# EAGLE design MD (EAGLE 9.6.2)

## Sheet 1 of 2
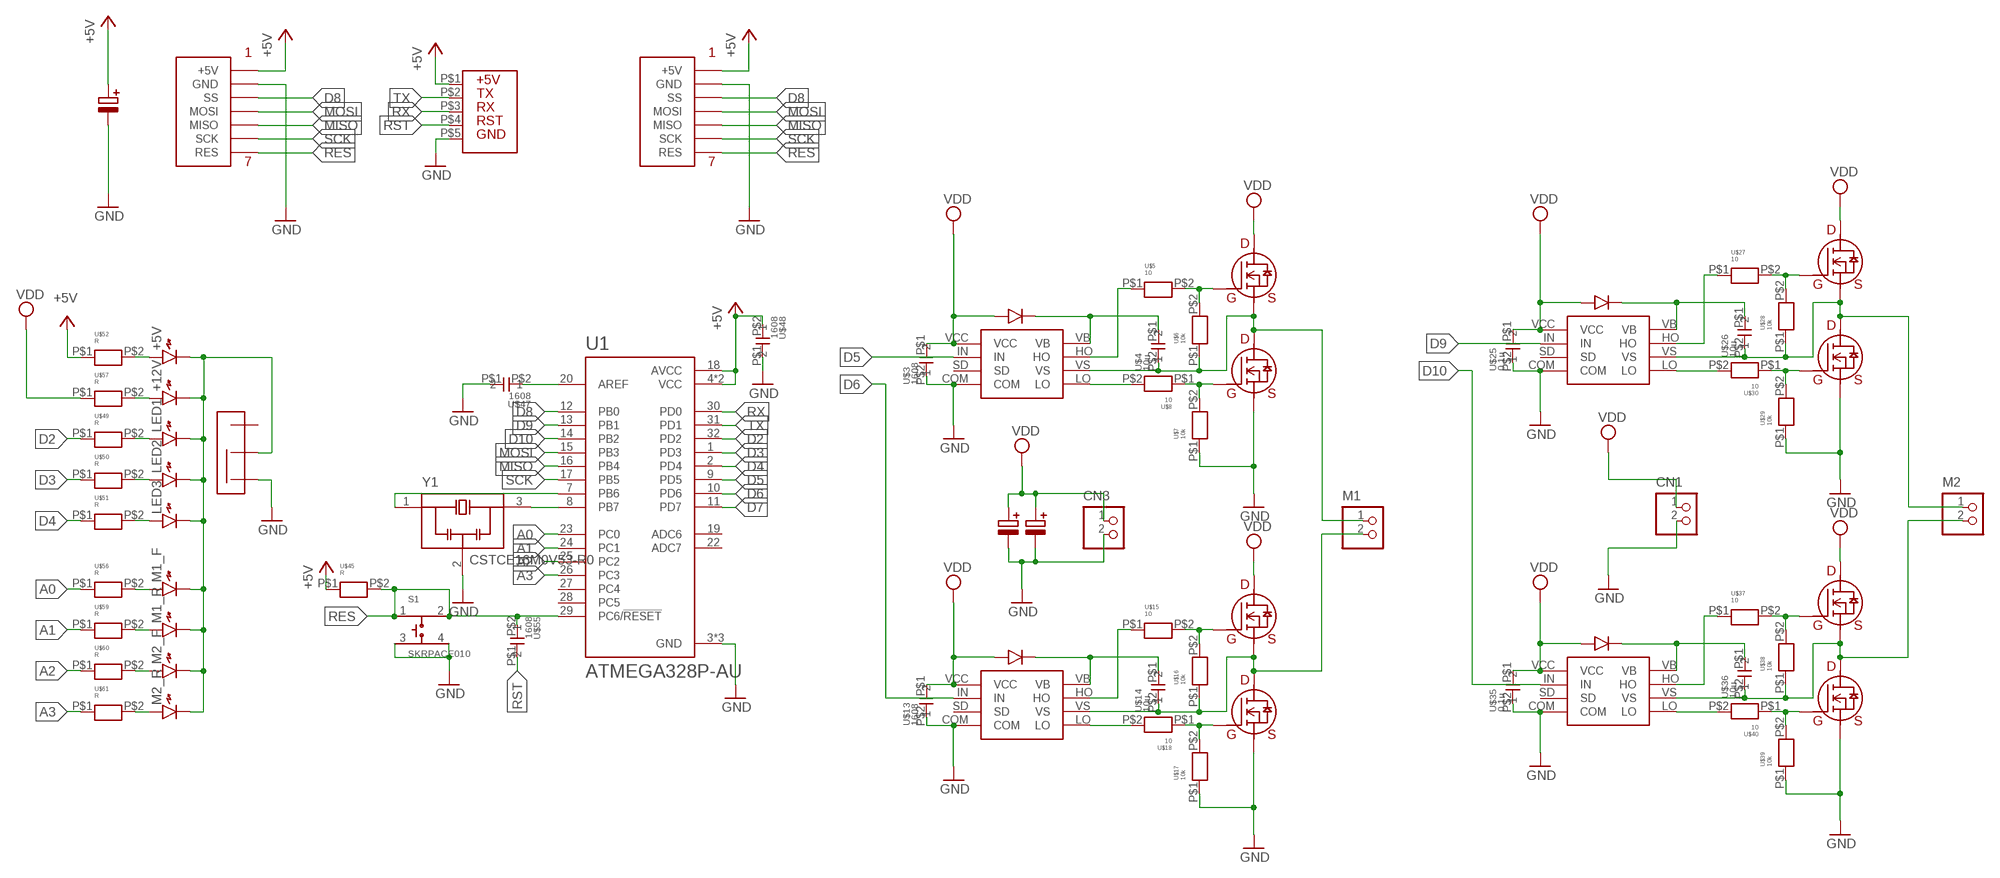
[diagram p0: schematic, sheet 1]

### Parts
+5V  LED1608  [LED1608]
+12V  LED1608  [LED1608]
CN1  B2B-XH-A  [B2B-XH-A]
CN3  B2B-XH-A  [B2B-XH-A]
LED1  LED1608  [LED1608]
LED2  LED1608  [LED1608]
LED3  LED1608  [LED1608]
M1  S2B-XH-A  [S2B-XH-A]
M1_F  LED1608  [LED1608]
M1_R  LED1608  [LED1608]
M2  S2B-XH-A  [S2B-XH-A]
M2_F  LED1608  [LED1608]
M2_R  LED1608  [LED1608]
S1  SKRPACE010  [SW_SKRPACE010]
U1  ATMEGA328P-AU  [QFP80P900X900X120-32N]
U$1  IR2302  [IR2302]
U$2  1N4148  [1N4148]
U$3  1608  [CON]
U$4  10u  1608  [CON]
U$5  10  R  [1608]
U$6  10k  R  [1608]
U$7  10k  R  [1608]
U$8  10  R  [1608]
U$9  TK8S06K3L  [TK8S06K3L]
U$10  TK8S06K3L  [TK8S06K3L]
U$11  IR2302  [IR2302]
U$12  1N4148  [1N4148]
U$13  1608  [CON]
U$14  10u  1608  [CON]
U$15  10  R  [1608]
U$16  10k  R  [1608]
U$17  10k  R  [1608]
U$18  10  R  [1608]
U$19  TK8S06K3L  [TK8S06K3L]
U$20  TK8S06K3L  [TK8S06K3L]
U$21  25V100  [25V100]
U$22  25V100  [25V100]
U$23  IR2302  [IR2302]
U$24  1N4148  [1N4148]
U$25  0.1u  1608  [CON]
U$26  10u  1608  [CON]
U$27  10  R  [1608]
U$28  10k  R  [1608]
U$29  10k  R  [1608]
U$30  10  R  [1608]
U$31  TK8S06K3L  [TK8S06K3L]
U$32  TK8S06K3L  [TK8S06K3L]
U$33  IR2302  [IR2302]
U$34  1N4148  [1N4148]
U$35  0.1u  1608  [CON]
U$36  10u  1608  [CON]
U$37  10  R  [1608]
U$38  10k  R  [1608]
U$39  10k  R  [1608]
U$40  10  R  [1608]
U$41  TK8S06K3L  [TK8S06K3L]
U$42  TK8S06K3L  [TK8S06K3L]
U$45  R  [1608]
U$46  SPI  [SPI]
U$47  1608  [CON]
U$48  1608  [CON]
U$49  R  [1608]
U$50  R  [1608]
U$51  R  [1608]
U$52  R  [1608]
U$53  SSW  [SSW]
U$54  SI  [SI]
U$55  1608  [CON]
U$56  R  [1608]
U$57  R  [1608]
U$58  25V100  [25V100]
U$59  R  [1608]
U$60  R  [1608]
U$61  R  [1608]
U$62  SPI  [SPI]
Y1  CSTCE16M0V53-R0  [OSC_CSTCE16M0V53-R0]

### Nets
+5V: U1.4(VCC) U1.6(VCC) U1.18(AVCC) U$45.P$1 U$46.P$1(+5V) U$48.P$2 U$52.P$1 U$54.P$1 U$58.P$1 U$62.P$1(+5V)
A0: U1.23(PC0) U$56.P$1
A1: U1.24(PC1) U$59.P$1
A2: U1.25(PC2) U$60.P$1
A3: U1.26(PC3) U$61.P$1
D2: U1.32(PD2) U$49.P$1
D3: U1.1(PD3) U$50.P$1
D4: U1.2(PD4) U$51.P$1
D5: U1.9(PD5) U$1.IN
D6: U1.10(PD6) U$11.IN
D7: U1.11(PD7)
D8: U1.12(PB0) U$46.P$3(SS) U$62.P$3(SS)
D9: U1.13(PB1) U$23.IN
D10: U1.14(PB2) U$33.IN
GND: CN1.2 CN3.2 S1.3 S1.4 U1.3(GND) U1.5(GND) U1.21(GND) U$1.COM U$3.P$2 U$7.P$1 U$10.S U$11.COM U$13.P$2 U$17.P$1 U$20.S U$21.P$2 U$22.P$2 U$23.COM U$25.P$2 U$29.P$1 U$32.S U$33.COM U$35.P$2 U$39.P$1 U$42.S U$46.P$2(GND) U$47.P$1 U$48.P$1 U$53.P$1 U$54.P$5 U$58.P$2 U$62.P$2(GND) Y1.2(GND)
MISO: U1.16(PB4) U$46.P$5(MISO) U$62.P$5(MISO)
MOSI: U1.15(PB3) U$46.P$4(MOSI) U$62.P$4(MOSI)
N$1: U$23.VB U$24.P$2 U$26.P$1
N$2: M2.1 U$23.VS U$26.P$2 U$28.P$1 U$31.S U$32.D
N$3: U$1.VB U$2.P$2 U$4.P$1
N$4: M1.1 U$1.VS U$4.P$2 U$6.P$1 U$9.S U$10.D
N$5: LED1.A U$49.P$2
N$6: U$5.P$2 U$6.P$2 U$9.G
N$7: U$1.HO U$5.P$1
N$8: U$1.LO U$8.P$2
N$9: U$7.P$2 U$8.P$1 U$10.G
N$10: U$27.P$2 U$28.P$2 U$31.G
N$11: U$23.HO U$27.P$1
N$12: U$11.VB U$12.P$2 U$14.P$1
N$13: M1.2 U$11.VS U$14.P$2 U$16.P$1 U$19.S U$20.D
N$14: U$15.P$2 U$16.P$2 U$19.G
N$15: U$11.HO U$15.P$1
N$16: U$11.LO U$18.P$2
N$17: U$17.P$2 U$18.P$1 U$20.G
N$18: LED2.A U$50.P$2
N$19: U$23.LO U$30.P$2
N$20: U$29.P$2 U$30.P$1 U$32.G
N$21: LED3.A U$51.P$2
N$22: U$33.VB U$34.P$2 U$36.P$1
N$23: M2.2 U$33.VS U$36.P$2 U$38.P$1 U$41.S U$42.D
N$24: U$37.P$2 U$38.P$2 U$41.G
N$25: U$33.HO U$37.P$1
N$26: U$33.LO U$40.P$2
N$27: U$39.P$2 U$40.P$1 U$42.G
N$28: +5V.A U$52.P$2
N$29: +5V.K +12V.K LED1.K LED2.K LED3.K M1_F.K M1_R.K M2_F.K M2_R.K U$53.P$3
N$30: +12V.A U$57.P$2
N$33: M1_R.A U$59.P$2
N$34: M1_F.A U$56.P$2
N$37: M2_R.A U$61.P$2
N$38: M2_F.A U$60.P$2
N$39: U1.8(PB7) Y1.3(OUT)
N$40: U1.7(PB6) Y1.1(IN)
N$47: U1.20(AREF) U$47.P$2
RES: S1.1 S1.2 U1.29(PC6/!RESET) U$45.P$2 U$46.P$7(RES) U$55.P$2 U$62.P$7(RES)
RST: U$54.P$4 U$55.P$1
RX: U1.30(PD0) U$54.P$3
SCK: U1.17(PB5) U$46.P$6(SCK) U$62.P$6(SCK)
TX: U1.31(PD1) U$54.P$2
VDD: CN1.1 CN3.1 U$1.VCC U$2.P$1 U$3.P$1 U$9.D U$11.VCC U$12.P$1 U$13.P$1 U$19.D U$21.P$1 U$22.P$1 U$23.VCC U$24.P$1 U$25.P$1 U$31.D U$33.VCC U$34.P$1 U$35.P$1 U$41.D U$57.P$1
Unconnected: U1.19(ADC6) U1.22(ADC7) U1.27(PC4) U1.28(PC5) U$1.SD U$11.SD U$23.SD U$33.SD U$53.P$2

## Sheet 2 of 2

## Library data of the parts
+5V +12V LED1-LED3 M1_F M1_R M2_F M2_R = generic:LED: Generic LEDs
CN1 CN3 = jst-xh:B2B-XH-A: Wire-to-Board 2.5mm pitch top mount connector Source: http://www.jst-mfg.com/product/pdf/jpn/XH.pdf http://www.jst-mfg.com/product/detail.php?series=277
M1 M2 = jst-xh:S2B-XH-A: Wire-to-Board 2.5mm pitch side mount connector Source: http://www.jst-mfg.com/product/pdf/jpn/XH.pdf http://www.jst-mfg.com/product/detail.php?series=277
S1 = SKRPACE010:SKRPACE010: Switch Tactile N.O. SPST Button J-Bend 0.05A 16VDC 2.55N SMD Automotive T/R Check prices <https://pricing.snapeda.com/parts/SKRPACE010/ALPS/view-part?ref=eda>; AVAILABILITY: In Stock; DESCRIPTION: Switch Tactile N.O. SPST Button J-Bend 0.05A 16VDC 2.55N SMD Automotive T/R; MF: ALPS; MP: SKRPACE010; PACKAGE: None; PRICE: None
U1 = ATMEGA328P-AU:ATMEGA328P-AU: ATmega Series 20 MHz 32 KB Flash 2 KB SRAM 8-Bit Microcontroller - TQFP-32 Check prices <https://pricing.snapeda.com/parts/ATMEGA328P-AU/Microchip%20Technology/view-part?ref=eda>; AVAILABILITY: In Stock; DESCRIPTION: AVR AVR® ATmega Microcontroller IC 8-Bit 20MHz 32KB (16K x 16) FLASH 32-TQFP (7x7); MF: Microchip Technology; MP: ATMEGA328P-AU; PACKAGE: TQFP-32 Microchip; PRICE: None
U$1 U$11 U$23 U$33 = IR2302:IR2302
U$2 U$12 U$24 U$34 = 1N4148:1N4148
U$3 U$4 U$13 U$14 U$25 U$26 U$35 U$36 U$47 U$48 U$55 = con1608:1608
U$5-U$8 U$15-U$18 U$27-U$30 U$37-U$40 U$45 U$49-U$52 U$56 U$57 U$59-U$61 = R 1608:R
U$9 U$10 U$19 U$20 U$31 U$32 U$41 U$42 = TK8S06K3L:TK8S06K3L
U$21 U$22 U$58 = 100uF25V 電解:25V100
U$46 U$62 = SPI用PH7ピン:SPI
U$53 = SSW:SSW
U$54 = プログラム入力:SI
Y1 = CSTCE16M0V53-R0:CSTCE16M0V53-R0: 20MHz Ceramic Resonator Built in Capacitor 15pF +/- 0.2% -40C - 125C Surface Mount; MANUFACTURER: Murata; MAXIMUM_PACKAGE_HEIGHT: 1.00mm; PARTREV: May 7, 2019; STANDARD: Manufacturer Recommendations

## Board
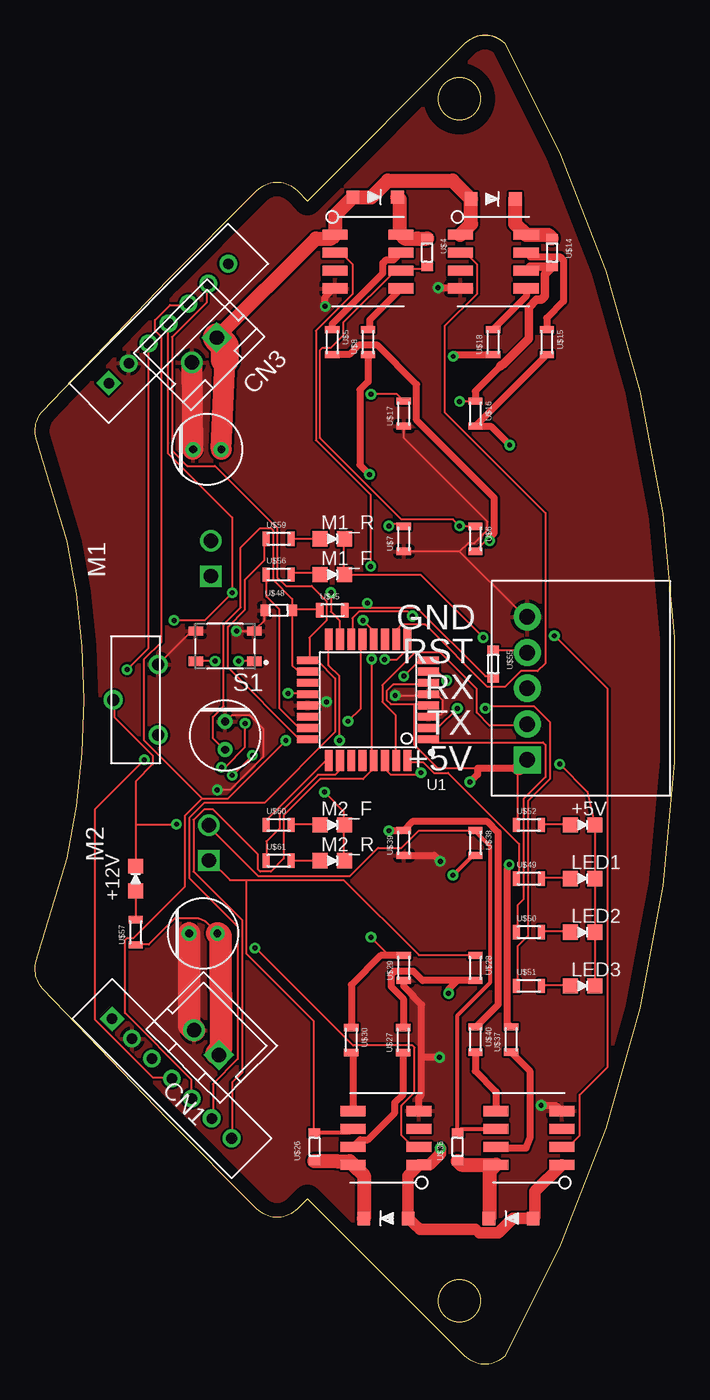
[diagram p1: board, top side]
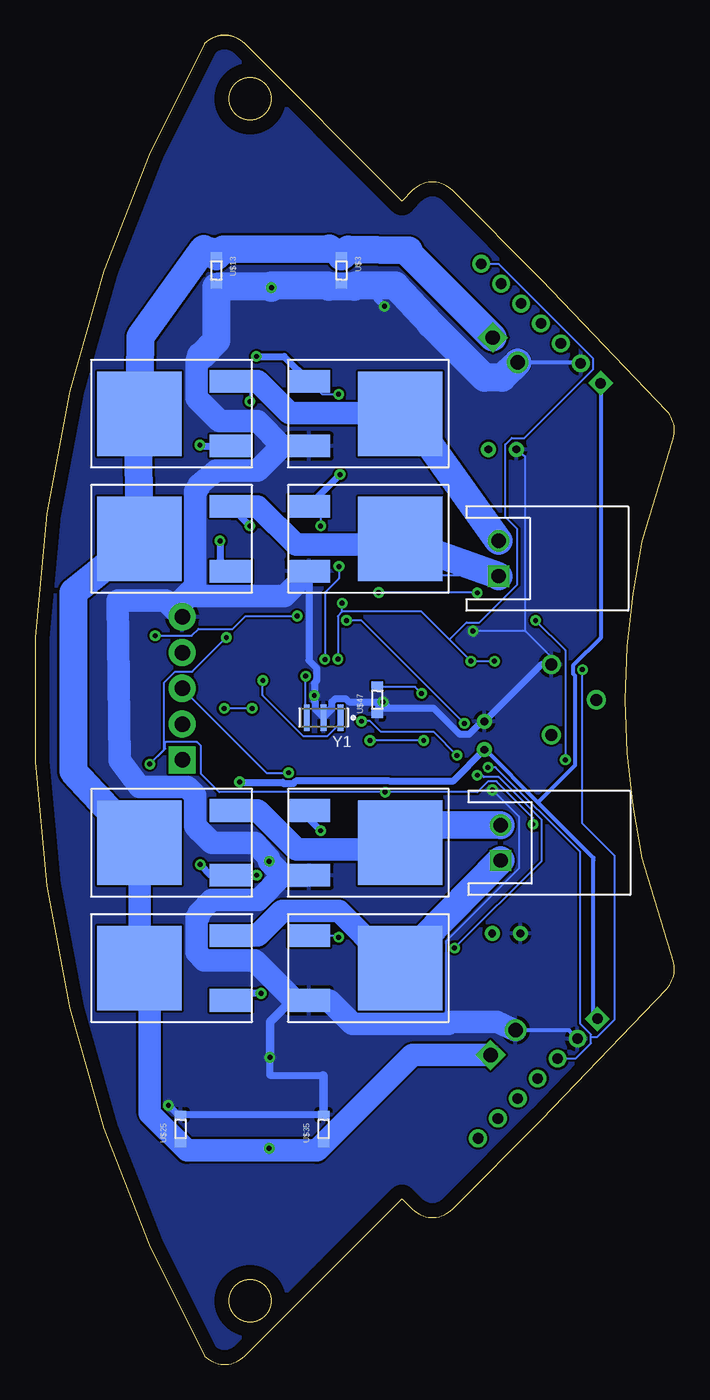
[diagram p2: board, bottom side, seen from below]

Size 45.4 x 94.38 mm. Coordinates in mm from the lower left corner, seen from the top.
Outline: 33.36,93.8 arc90 30.54,93.8
Outline: 30.54,93.8 19.35,82.61 18.6,83.37 arc90 15.77,83.37 9.41,77 0.55,67.71 arc60 0.08,65.75 2.27,58.46 arc-24 2.27,35.92 0.08,28.63 arc60 0.55,26.68 9.41,17.38 15.77,11.02 arc90 18.6,11.02 19.35,11.77 30.54,0.58 arc90 33.36,0.58 arc58 33.36,93.8
Outline: 30.54,93.8 arc-90 33.36,93.8
Outline: circle at 30.14,89.87 radius 1.5
Outline: circle at 30.14,89.87 radius 1.5
Outline: circle at 30.14,4.52 radius 1.5
Copper layers (1*16): Top 0.035mm / dielectric 1.5mm / Bottom 0.035mm
Design rules "default": minimum track width 6mil, minimum drill 0.35mm, track to track 6mil, track to pad 6mil, pad to pad 6mil, via to via 6mil, smd to smd 6mil, copper to edge 40mil, drill to drill 6mil, minimum pad ring 10mil, minimum via ring 8mil, stop-mask expansion 4mil, vias tented up to drill 0mil, thermal gap 10mil

### Footprints (pad centres in the part's own frame; a part is rotated, then mirrored left to right if it is on the bottom)
LED1608 = smd 1.05 x 1.08: A -0.875,0; K 0.875,0
B2B-XH-A = drill 1.016 square: 1 -1.25,0 | drill 1.016: 2 1.25,0
S2B-XH-A = drill 1.016 square: 1 1.25,0 | drill 1.016: 2 -1.25,0
SW_SKRPACE010 = smd 1.05 x 0.65: 1 -2.075,1.075; 2 2.075,1.075; 3 -2.075,-1.075; 4 2.075,-1.075
QFP80P900X900X120-32N = smd 1.5 x 0.55: 1 -4.3,2.8; 2 -4.3,2; 3 -4.3,1.2; 4 -4.3,0.4; 5 -4.3,-0.4; 6 -4.3,-1.2; 7 -4.3,-2; 8 -4.3,-2.8; 17 4.3,-2.8; 18 4.3,-2; 19 4.3,-1.2; 20 4.3,-0.4; 21 4.3,0.4; 22 4.3,1.2; 23 4.3,2; 24 4.3,2.8 | smd 0.55 x 1.5: 9 -2.8,-4.3; 10 -2,-4.3; 11 -1.2,-4.3; 12 -0.4,-4.3; 13 0.4,-4.3; 14 1.2,-4.3; 15 2,-4.3; 16 2.8,-4.3; 25 2.8,4.3; 26 2,4.3; 27 1.2,4.3; 28 0.4,4.3; 29 -0.4,4.3; 30 -1.2,4.3; 31 -2,4.3; 32 -2.8,4.3
IR2302 = smd 1.78 x 0.72: COM -2.34,0; HO 2.34,2.54; IN -2.34,2.54; LO 2.34,0; SD -2.34,1.27; VB 2.34,3.81; VCC -2.34,3.81; VS 2.34,1.27
1N4148 = smd 0.9 x 0.95: P$1 -1.575,0; P$2 1.575,0
CON = smd 0.6 x 0.813: P$1 -1,0; P$2 1,0
1608 = smd 0.508 x 1.016: P$1 -0.889,0; P$2 0.889,0
TK8S06K3L = smd 6 x 6: D 0,8 | smd 1.6 x 3: G -2.3,1.5; S 2.3,1.5
25V100 = drill 0.55: P$1 -1,0; P$2 1,0
SPI = drill 0.75 square: P$1 0,0 | drill 0.75: P$2 2,0; P$3 4,0; P$4 6,0; P$5 8,0; P$6 10,0; P$7 12,0
SSW = drill 0.85: P$1 -2.5,1.6; P$2 2.5,1.6; P$3 0,-1.6
SI = drill 1.1 pad 1.93 square: P$1 -7.62,0 | drill 1.1 pad 1.93: P$2 -5.08,0; P$3 -2.54,0; P$4 0,0; P$5 2.54,0
OSC_CSTCE16M0V53-R0 = smd 0.4 x 1.9: 1 -1.2,0; 2 0,0; 3 1.2,0

### Placement (x,y rotation side)
+5V  38.89,38.3 0 top
+12V  7.14,34.49 90 top
CN1  12.17,22.84 135 top
CN3  12.02,72.03 225 top
LED1  38.89,34.49 0 top
LED2  38.89,30.68 0 top
LED3  38.89,26.87 0 top
M1  12.47,57.22 270 bottom
M1_F  21.11,56.08 0 top
M1_R  21.11,58.62 0 top
M2  12.34,37.03 270 bottom
M2_F  21.11,38.3 0 top
M2_R  21.11,35.76 0 top
S1  13.49,51 180 top
U1  23.65,47.19 180 top
U$1  23.65,76.4 0 top
U$2  24.15,82.88 0 top
U$3  23.65,77.67 270 bottom
U$4  27.84,78.94 270 top
U$5  21.11,72.59 270 top
U$6  31.27,58.62 270 top
U$7  26.19,58.62 90 top
U$8  23.65,72.59 90 top
U$9  30,58.62 90 bottom
U$10  27.46,58.62 270 bottom
U$11  32.54,76.4 0 top
U$12  32.54,82.75 0 top
U$13  32.54,77.67 270 bottom
U$14  36.73,78.94 270 top
U$15  36.35,72.59 270 top
U$16  31.27,67.51 270 top
U$17  26.19,67.51 90 top
U$18  32.54,72.59 90 top
U$19  30,67.51 90 bottom
U$20  27.46,67.51 270 bottom
U$21  11.94,30.6 180 top
U$22  12.22,64.97 180 top
U$23  24.92,17.98 180 top
U$24  24.92,10.36 180 top
U$25  35.08,16.71 90 bottom
U$26  19.84,15.44 90 top
U$27  26.15,23.02 90 top
U$28  31.27,28.14 270 top
U$29  26.19,28.14 90 top
U$30  22.45,23.02 270 top
U$31  30,28.14 90 bottom
U$32  27.46,28.14 270 bottom
U$33  35.08,17.98 180 top
U$34  33.81,10.36 180 top
U$35  24.92,16.71 90 bottom
U$36  30,15.44 90 top
U$37  33.81,23.06 90 top
U$38  31.27,37.03 270 top
U$39  26.19,37.03 90 top
U$40  31.27,23.06 270 top
U$41  30,37.03 90 bottom
U$42  27.46,37.03 270 bottom
U$45  21.11,53.54 0 top
U$46  5.46,24.53 315 top
U$47  21.11,47.19 90 bottom
U$48  17.3,53.54 0 top
U$49  35.08,34.49 0 top
U$50  35.08,30.68 0 top
U$51  35.08,26.87 0 top
U$52  35.08,38.3 0 top
U$53  7.14,47.19 270 top
U$54  34.96,50.54 90 top
U$55  32.54,49.73 270 top
U$56  17.3,56.08 0 top
U$57  7.14,30.68 90 top
U$58  13.49,44.65 90 top
U$59  17.3,58.62 0 top
U$60  17.3,38.3 0 top
U$61  17.3,35.76 0 top
U$62  5.23,69.67 45 top
Y1  24.92,45.92 180 bottom

### Tracks (layer width: path | path; a pad name or v marks a point on that pad's centre or on a via)
+5V  (via drill 0.35)
  Top 0.152: 26.95,46.89 25.27,46.89 24.97,47.19 24.97,47.8 25.42,48.26 27.86,48.26 U1.6 | 26.95,46.89 27.86,46.89 U1.4 | U$52.P$1 34.26,38.35 34.26,42.01 33.96,42.31 31.42,42.31 28.62,42.31 26.95,43.99 26.95,46.89 | U$48.P$2 18.41,53.59 20.09,53.59 U$45.P$1 | U1.18 19.33,49.33 18.57,49.33 18.26,49.63 18.26,53.44 U$48.P$2 | U$48.P$2 18.26,53.59 18.26,54.35 16.89,55.73 16.89,59.23 16.74,59.38 15.98,59.38 14.6,58.01 14.6,53.74 13.38,52.53 13.38,46.73 12.62,45.97 12.62,44.45 13.38,43.69 U$58.P$1
  Top 0.5: v30.89,41.35 31.42,41.88 31.42,42.31 34.35,42.31
  Top 1: U$54.P$1 34.35,42.31
  Bottom 0.152: 13.38,43.53 U$58.P$1 | 16.03,41.4 30.89,41.4 v30.89,41.35
  Bottom 0.3: 9.69,39.92 7.07,42.54 7.07,48.9 7.21,49.04 7.21,49.61 5.23,51.58 U$62.P$1 | U$46.P$1 5.74,24.81 5.74,35.81 | 5.78,35.85 5.74,35.81 | 5.74,35.81 5.74,35.97 9.69,39.92 | U$58.P$1 13.42,43.65 9.69,39.92
  Bottom 0.5: U$58.P$1 15.74,41.4 16.03,41.4 20.21,41.4 20.22,41.42 26.89,41.42 27.08,41.23 27.73,41.23 27.82,41.32 30.86,41.32 v30.89,41.35
A0
  Top 0.152: U$56.P$1 16.43,56.03 16.43,54.51 17.35,53.59 17.35,46.58 18.72,45.21 19.33,45.21 U1.23
A1
  Top 0.152: U$59.P$1 16.28,58.62 16.28,57.1 14.91,55.73 14.91,53.59 13.69,52.37 13.69,49.48 18.72,44.45 19.33,44.45 U1.24
A2
  Top 0.152: U$60.P$1 16.43,38.35 16.43,38.66 20.7,42.92 U1.25
A3
  Top 0.152: U$61.P$1 16.43,35.76 16.43,37.13 17.35,38.05 17.35,39.11 20.09,41.86 21.31,41.86 21.61,42.16 21.61,42.77 U1.26
D2
  Top 0.152: U$49.P$1 34.37,34.67 34.37,36.97 29.32,42.01 28.32,42.01 27.56,42.77 26.49,42.77 U1.32
D3
  Top 0.152: U$50.P$1 34.26,30.73 34.26,32.59 34.7,33.02 34.7,40.16 36.24,41.71 36.24,43.99 36.07,44.17 28.14,44.17 28.02,44.3 U1.1
D4  (via drill 0.35)
  Top 0.152: v31.98,46.58 32.09,46.7 35.47,46.7 36.55,45.62 36.55,41.55 35.01,40.02 35.01,30.41 34.26,29.67 34.26,26.92 U$51.P$1 | v30,46.58 28.62,45.21 28.02,45.21 U1.2
  Bottom 0.152: v30,46.58 v31.98,46.58
D5  (via drill 0.35)
  Top 0.152: v24.83,50.06 25.7,50.06 26.34,50.7 26.34,51.46 U1.9 | v23.82,56.67 23.82,61.75 19.94,65.63 19.94,73.4 22.53,76 22.53,78.13 21.77,78.89 21.31,78.89 U$1.IN
  Bottom 0.152: v24.83,50.06 24.83,54.8 23.82,55.8 v23.82,56.67
D6
  Top 0.152: U1.10 25.73,51.61 25.73,52.22 26.03,52.53 27.71,52.53 32.13,48.11 33.37,48.11 34.49,49.22 35.69,49.22 36.24,49.78 36.24,60.45 29.08,67.61 29.08,73.71 31.37,76 31.37,78.13 30.61,78.89 30.3,78.89 U$11.IN
D8  (via drill 0.35)
  Top 0.152: v23.29,52.83 23.9,52.22 23.9,51.61 U1.12 | v14.91,45.52 14.91,43.83 13.47,42.39 v13.23,42.39 | v6.53,49.33 8.05,50.85 8.05,72.49 U$62.P$3
  Bottom 0.152: v23.29,52.83 22.22,52.83 v14.91,45.52 | v13.23,42.39 12.7,42.39 6.68,36.37 6.68,24.18 5.92,23.42 5.92,23.26 | 5.92,23.26 5.92,22.81 6.98,21.74 8.2,21.74 U$46.P$3 | v6.53,49.33 6.53,38.4 4.24,36.12 4.24,24.48 5.46,23.26 5.92,23.26
D9  (via drill 0.35)
  Top 0.152: v22.22,45.67 23.14,46.58 23.14,51.46 U1.13 | v15.43,43.24 14.02,41.83 v13.99,41.83 | v15.61,29.56 15.66,29.56 22.58,22.64 26.81,22.64 26.95,22.5 26.95,19.3 26.03,18.39 26.03,16.25 26.8,15.49 27.25,15.49 U$23.IN
  Bottom 0.152: v22.22,45.67 21.61,45.67 20.85,44.91 17.09,44.91 v15.43,43.24 | v13.99,41.83 13.66,41.83 13.54,41.71 12.47,41.71 9.42,38.66 9.42,35.75 v15.61,29.56
D10  (via drill 0.35)
  Top 0.152: v26.8,53.14 26.49,53.44 22.99,53.44 22.53,52.98 22.53,51.61 U1.14 | v36.88,51.74 40.66,47.95 40.66,21.13 38.68,19.15 38.68,16.25 37.92,15.49 37.46,15.49 U$33.IN
  Bottom 0.152: v26.8,53.14 30.45,53.14 31.37,52.22 33.81,52.22 34.29,51.74 v36.88,51.74
GND  (via drill 0.35)
  Top 0.152: U$29.P$1 26.19,26.62 27.25,25.55 | 27.25,25.55 27.25,18.08 U$23.COM | 27.25,25.55 27.46,25.55 | U$21.P$2 10.95,24.05 CN1.2 | 30,76.45 30.15,76.45 U$11.COM | 21.11,76.3 21.16,76.3 U$1.COM | 30.15,57.71 26.19,57.71 U$7.P$1 | 30.15,57.71 34.41,53.44 U$54.P$5 | U$17.P$1 26.19,65.78 32.13,59.84 32.13,59.23 31.22,58.32 30.76,58.32 30.15,57.71 | U$48.P$1 16.28,53.44 16.28,52.83 15.67,52.22 S1.3 15.52,52.07 v14.3,52.07 | S1.4 11.1,52.07 8.81,49.78 U$53.P$1 | U1.3 28.02,46.12 28.78,46.12 28.93,46.28 28.93,47.19 28.62,47.5 28.02,47.5 U1.5 27.86,47.5 v25.58,47.5 | v20.7,47.04 20.55,46.89 19.48,46.89 U1.21 | v12.93,40.79 13.84,40.79 16.18,43.13 16.18,45.16 15.21,46.12 13.99,46.12 13.54,45.67 U$58.P$2
  Top 0.5: U$23.COM 27.26,18.93 27.43,19.1 27.43,21.79 | 27.46,25.55 27.43,25.52 | 27.43,21.79 27.43,25.52 | 27.43,25.52 26.84,26.11 26.84,26.19 26.19,26.84 U$29.P$1 | v35.94,18.39 37.01,18.39 U$33.COM | v28.73,21.79 27.43,21.79 | v28.62,76.45 30,76.45 | v20.6,75.13 20.6,75.79 21.11,76.3 | U$39.P$1 28.35,36.14 v28.77,35.72 v28.78,35.72
  Top 1.5: U$22.P$2 CN3.2
  Top 1.6: U$21.P$2 10.94,24.03 10.97,24.03 CN1.2
  Bottom 0.152: 35.03,17.78 U$25.P$2 | 33.35,29.67 33.35,32.23 33.07,32.51 30.96,32.51 28.78,34.69 27.84,34.69 26.19,34.69 26.03,34.69 U$42.S | 22.78,23.87 16.22,23.87 | 16.22,23.87 11.81,23.87 CN1.2 | 28.62,76.6 32.43,76.6 U$13.P$2 32.59,76.6 33.35,75.84 33.35,71.32 33.35,68.98 31.77,67.41 31.01,67.41 28.93,65.33 26.03,65.33 U$20.S | 28.62,76.6 23.75,76.6 U$3.P$2 | 28.62,76.6 v28.62,76.45 | 10.59,52.07 v14.3,52.07 | 8.97,49.93 8.81,49.78 U$53.P$1 8.97,49.93 | 10.59,52.07 8.46,49.93 8.97,49.93 | 8.97,49.93 9.12,49.93 13.38,45.67 U$58.P$2 | 24.81,46.43 25.05,46.19 25.56,46.71 25.56,47.48 v25.58,47.5 25.58,49.52 25.7,49.64 | 24.81,46.43 24.05,47.19 21.11,47.19 U$47.P$1 21,46.28 20.7,46.58 v20.7,47.04 | 24.81,46.43 24.81,45.97 Y1.2 | 34.89,53.2 U$54.P$5 | 10.59,52.07 10.59,64.43 U$22.P$2 | 16.22,23.87 16.22,30.03 11.04,35.22 11.04,38.9 v12.93,40.79
  Bottom 0.2: 21.11,76.4 U$3.P$2
  Bottom 0.3: U$62.P$2 6.71,71.15 CN3.2 | U$46.P$2 7.49,23.73 CN1.2
  Bottom 0.5: U$35.P$2 34.96,17.71 35.03,17.78 | U$25.P$2 35.26,17.71 v35.94,18.39 | 24.97,20.52 28.73,20.52 v28.73,21.79 | v20.6,75.13 21.11,75.64 21.11,76.4 | U$10.S 25.96,49.99 25.41,49.43 25.41,48.54 25.58,48.37 v25.58,47.5 25.58,47.1 25.51,47.04 25.51,46.52 Y1.2 24.32,46.52 24.32,47.04 24.08,47.27 23.35,47.27 23.12,47.04 v20.7,47.04 | 20.24,46.58 17.08,46.58 15.23,44.73 14.59,44.73 13.67,45.65 U$58.P$2 9.45,49.69 U$53.P$1 | 20.24,46.58 20.7,46.58 | v20.7,47.04 21,46.73 21,46.28 | v20.7,47.04 20.24,46.58
  Bottom 0.6: 24.97,20.52 24.92,20.47 U$35.P$2 | v28.73,21.79 28.73,24.33 27.46,25.6 26.19,25.6 U$32.S
  Bottom 1: 33.63,71.6 33.35,71.32
  Bottom 1.6: 33.63,71.6 33.95,71.29 33.95,68.62 32.3,66.96 29.6,66.96 27.85,65.21 | U$20.S 27.85,65.21 | 27.85,65.21 29.6,63.46 32.54,63.46 33.81,62.43 33.81,62.26 34.04,62.02 34.04,55.23 34.7,54.57 | U$10.S 27.7,54.57 34.7,54.57 | 34.7,54.57 34.96,54.31 U$54.P$5 36.13,54.25 39.53,54.25 39.39,42.87 37.98,40.99 34.61,40.99 34.04,40.43 34.04,38.23 33.81,37.99 33.81,37.92 33.73,37.92 32.84,37.03 29.8,37.03 28.78,35.93 v28.78,35.72 27.75,34.69 26.19,34.69 | U$32.S 26.98,25.84 29.83,28.69 33.39,28.69 33.95,29.25 33.95,31.64 | 33.95,31.64 33.81,31.78 33.81,32.03 32.86,32.98 29.54,32.98 27.82,34.71 | 33.95,31.73 33.95,31.64 | U$42.S 27.84,34.69 | CN1.2 12.62,24.33 15.92,24.33 16.06,24.19 22.85,24.19 24.52,25.86
  Bottom 2: CN3.2 12.22,70.05 13.49,70.05 17.3,73.86 19.84,76.6 22.67,76.6 22.75,76.52 24.54,76.52 24.62,76.6 28.62,76.6 | v28.62,76.45 28.69,76.52 32.54,76.52 32.54,72.7 33.63,71.6
  pour Bottom: -10.64,95.45 -10.64,34.49 30,-6.15 56.67,20.52 56.67,100.53 -5.56,100.53
  pour Top: -5.56,97.99 -5.56,29.41 27.46,-3.61 50.32,-3.61 57.94,4.01 57.94,101.8 -1.75,101.8
MISO  (via drill 0.35)
  Top 0.152: v21.61,44.3 21.61,48.87 20.85,49.63 20.85,51.46 U1.16 | v17.8,44.3 13.69,40.18 11.86,40.18 | 11.86,40.18 10.64,38.96 10.64,33.93 6.98,30.28 6.53,30.28 6.37,30.12 6.37,24.94 11.1,20.22 11.1,19 U$46.P$5 | 11.86,40.18 7.75,44.3 7.75,50.09 8.97,51.31 8.97,72.95 8.51,73.4 8.51,74.17 9.57,75.23 10.79,75.23 U$62.P$5
  Bottom 0.152: v17.8,44.3 v21.61,44.3
MOSI  (via drill 0.35)
  Top 0.152: v21,54.81 21,53.44 21.61,52.83 21.61,51.61 U1.15 | U$62.P$4 9.42,73.86 9.42,64.72 13.99,60.15 v13.99,54.79 12.04,52.83 v9.85,52.83 | v7.75,42.92 4.24,39.42 4.24,24.48 8.36,20.37 9.57,20.37 U$46.P$4
  Bottom 0.152: v21,54.81 14.02,54.81 v13.99,54.79 | v7.75,42.92 7.75,50.72 v9.85,52.83
N$1
  Top 0.152: 22.54,14.25 U$23.VB
  Top 1: U$26.P$1 21.4,14.44 21.42,14.43 22.36,14.43 22.54,14.25 | U$23.VB 23.34,13.41 U$24.P$2
N$2
  Top 0.152: 15,34.39 13.84,34.39 12.47,35.76 M2.1 | 15,34.39 21.92,34.39 27.25,29.06 31.22,29.06 U$28.P$1 | 15,34.39 15,29.17 19.79,24.38 19.79,16.56 U$26.P$2
  Top 0.3: U$23.VS 22.31,16.44 U$26.P$2
  Bottom 0.152: 28.62,30.43 31.37,30.43 U$31.S | 19.84,28.14 U$32.D 19.33,28.14 19.33,28.9 12.47,35.76 M2.1
  Bottom 1.6: U$31.S 29.6,30.44 27.85,32.19 23.84,32.19 20.55,28.9 19.33,28.9
  Bottom 2: M2.1 19.84,28.14
N$3
  Top 0.152: U$2.P$2 25.88,82.85 25.88,80.26 U$1.VB
  Top 1: U$2.P$2 25.88,82.73 25.88,80.26 | U$1.VB 26.24,79.95 27.15,79.95 27.16,79.94 U$4.P$1
N$4  (via drill 0.35)
  Top 0.152: U$4.P$2 27.71,77.82 26.19,77.82 26.03,77.67 U$1.VS 25.58,77.67 21.92,74.01 21.92,73.1 21,72.19 20.4,72.19 20.24,72.03 20.24,65.78 26.03,59.99 29.69,59.99 v30.15,59.54 31.22,59.54 U$6.P$1
  Bottom 0.152: M1.1 12.47,56.03 16.74,56.03 19.33,58.62 U$10.D 19.84,58.62
  Bottom 0.5: v30.15,59.54 U$9.S
  Bottom 1.6: U$9.S 29.6,60.92 26.89,58.21 20.69,58.21 19.84,57.35 19.84,58.62
  Bottom 2: M1.1 19.84,58.62
N$5
  Top 0.152: U$49.P$2 36.09,34.54 37.92,34.54 LED1.A
N$6  (via drill 0.35)
  Top 0.152: 32.13,58.62 32.67,59.17 32.67,61.44 | 32.13,58.62 31.37,57.86 U$6.P$2 | 21.16,71.73 U$5.P$2 | 32.13,58.62 v32.28,58.47
  Top 0.5: v32.28,58.47 32.28,58.71 32.61,59.03 32.61,61.53 27.1,67.04 27.1,69.58 24.32,72.36 22.97,72.36 22.32,71.7 U$5.P$2
  Bottom 0.5: v32.28,58.47 32.28,57.11 U$9.G
N$7
  Top 0.5: U$5.P$1 21.11,73.9 24.69,77.48 24.69,78.2 24.93,78.43 25.48,78.43 U$1.HO
N$8
  Top 0.152: 23.75,73.56 U$8.P$2
  Top 0.5: U$1.LO 23.75,74.16 23.75,73.56
N$9  (via drill 0.35)
  Top 0.152: v25.12,59.54 25.25,59.66 26.19,59.66 U$7.P$2
  Top 0.5: U$8.P$1 23.65,69.78 23.07,69.21 23.07,63.87 v23.75,63.19
  Bottom 0.152: v25.12,59.54 25.12,60.15 25.88,60.91 U$10.G 25.88,61.06
  Bottom 0.5: v23.75,63.19 25.88,61.06
N$10  (via drill 0.35)
  Top 0.152: U$27.P$2 26.15,26.2 25.42,26.92 25.42,27.68 25.58,27.84 26.95,27.84 27.53,27.25 30,27.25
  Top 0.5: U$27.P$2 26.15,25.96 25.28,26.83 25.28,27.67 25.51,27.91 26.86,27.91 27.52,27.25 30,27.25 | U$28.P$2 30,27.25 | v29.36,26.34 29.36,26.62 30,27.25
  Bottom 0.152: 31.3,25.86 U$31.G
  Bottom 0.5: v29.36,26.34 30.82,26.34 31.3,25.86
N$11
  Top 0.5: U$23.HO 23.08,15.95 23.63,15.95 25.56,17.87 25.56,18.59 26.15,19.18 U$27.P$1
N$12
  Top 0.152: 36.7,79.96 U$14.P$1
  Top 1: 36.7,79.96 36.45,80.21 U$11.VB 34.11,80.98 U$12.P$2
N$13  (via drill 0.35)
  Top 0.152: 31.37,69.14 31.37,68.53 U$16.P$1 31.24,68.38 v30.15,68.38 | 35.33,77.67 U$11.VS
  Top 0.5: U$16.P$1 31.27,69.1 33.01,70.85 33.45,71.28
  Top 0.6: 33.01,70.85 33.16,71 33.23,71 35.08,72.84 35.08,75.05 35.61,75.59 35.95,75.59 36.22,75.85 36.22,77.43 U$14.P$2 35.15,77.94 U$11.VS
  Bottom 0.152: 30.15,69.75 28.62,69.75 26.49,67.61 19.48,67.61 U$20.D 19.46,66.45 12.6,59.59 12.6,58.6 M1.2 | 30.15,69.75 31.37,69.75 U$19.S 30.15,69.75 | 30.15,69.75 v30.15,68.38
  Bottom 1.6: U$19.S 29.6,69.81 27.34,67.55 19.5,67.55 U$20.D
  Bottom 2: M1.2 19.84,68.78
N$14  (via drill 0.35)
  Top 0.152: 31.37,66.7 U$16.P$2
  Top 0.5: U$15.P$2 31.37,66.72 31.37,66.7 | U$16.P$2 32.36,66.62 v33.7,65.28
  Bottom 0.5: v33.7,65.28 33.64,65.21 U$19.G
N$15
  Top 0.5: U$15.P$1 36.35,74.3 37.54,75.49 37.54,78.41 37.3,78.64 35.17,78.64 U$11.HO
N$16
  Top 0.152: 32.59,73.56 U$18.P$2
  Top 0.5: U$11.LO 34.88,75.85 32.59,73.56
N$17  (via drill 0.35)
  Top 0.152: U$17.P$2 25.7,68.88 v23.85,68.88
  Top 0.5: v29.69,71.58 29.82,71.7 U$18.P$1
  Bottom 0.152: v23.85,68.88 25.02,68.88 25.88,69.75 U$20.G 26.03,69.9 27.71,71.58
  Bottom 0.5: v29.69,71.58 27.71,71.58 25.88,69.75
N$18
  Top 0.152: U$50.P$2 36.09,30.73 37.92,30.73 LED2.A
N$19
  Top 0.5: U$30.P$2 22.58,22.01 U$23.LO
N$20  (via drill 0.35)
  Top 0.152: U$30.P$1 22.45,26.9 24.87,29.31 | U$29.P$2 25.28,29.03 25.21,28.96 24.87,29.31 | 24.87,29.31 v23.85,30.33
  Top 0.5: U$29.P$2 24.54,29.03 22.45,26.95 U$30.P$1
  Bottom 0.152: U$32.G 23.97,30.44 v23.85,30.33
N$21
  Top 0.152: U$51.P$2 36.09,26.92 37.92,26.92 LED3.A
N$22
  Top 0.152: 32.28,10.46 U$34.P$2
  Top 1: U$36.P$1 30.27,14.17 U$33.VB 32.28,13.72 32.28,10.46
N$23
  Top 0.152: M2.2 12.32,38.2 15.82,34.69 22.38,34.69 24.36,36.68 26.03,36.68 27.25,37.9 31.22,37.9 U$38.P$1 31.37,37.9
  Top 0.3: 31.22,37.9 32.33,36.78 32.33,27.12 30,24.79 U$36.P$2 30.27,16.71 U$33.VS
  Bottom 0.152: U$41.S 31.37,39.27 28.62,39.27 26.49,37.13 19.48,37.13 U$42.D 18.85,37.51 14.05,37.51 13.84,37.72 12.97,38.28 M2.2
  Bottom 1.6: U$41.S 29.6,39.33 26.84,36.56 19.37,36.56 18.57,35.76
  Bottom 2: M2.2 19.84,38.3
N$24  (via drill 0.35)
  Top 0.3: v29.67,34.73 31.08,36.14 U$38.P$2
  Top 0.5: v33.68,35.48 33.68,35.31 33.53,35.17 33.53,24.23 U$37.P$2
  Bottom 0.152: v33.68,35.48 32.9,34.71 31.52,34.71 U$41.G | 31.27,34.73 31.25,34.74
  Bottom 0.3: v29.67,34.73 U$41.G | U$41.G
  Bottom 0.5: v33.68,35.48 32.93,34.73 U$41.G 31.27,34.73
N$25
  Top 0.5: U$37.P$1 35.14,20.84 35.14,16.04 34.86,15.34 32.84,15.34 U$33.HO
N$26
  Top 0.5: U$40.P$2 31.27,20.83 32.74,19.36 U$33.LO
N$27  (via drill 0.35)
  Top 0.152: 31.37,24.03 U$40.P$1 | 26.19,37.9 U$39.P$2
  Top 0.5: v25.12,37.9 26.19,37.9 | U$39.P$2 26.84,38.58 32.08,38.58 32.88,37.78 32.88,25.54 31.37,24.03
  Bottom 0.5: U$42.G 25.96,38.73 v25.12,37.9
N$28
  Top 0.152: U$52.P$2 36.09,38.35 37.92,38.35 +5V.A
N$29  (via drill 0.35)
  Top 0.152: LED3.K 39.75,26.92 39.75,30.58 LED2.K 39.75,30.73 39.75,34.39 LED1.K 39.75,34.54 39.75,38.2 +5V.K 39.24,40.64 v37.26,42.62 | M1_R.K 21.92,58.62 21.92,56.18 M1_F.K 22.07,56.03 27.41,56.03 v31.83,51.61 | M2_R.K 21.92,35.76 21.92,38.2 M2_F.K 21.92,38.35 21.92,39.27 v20.55,40.64 | 7.14,38.35 7.14,41.4 8.36,42.62 8.36,43.23 5.61,45.97 5.61,47.19 U$53.P$3 | 7.14,38.35 +12V.K | 7.14,38.35 v10.03,38.35
  Bottom 0.152: v10.03,38.35 10.03,38.81 12.62,41.4 13.23,41.4 13.99,40.64 v20.55,40.64 32.33,40.64 33.63,41.93 33.63,43.89 33.92,44.18 36.12,44.18 | 36.14,44.16 36.24,44.06 36.12,44.18 | v31.83,51.61 34.24,49.2 35.46,49.2 36.24,48.41 36.24,43.64 v37.26,42.62 36.16,43.72 36.16,44.15 36.12,44.18
N$30
  Top 0.152: +12V.A U$57.P$2
N$33
  Top 0.152: M1_R.A U$59.P$2
N$34
  Top 0.152: U$56.P$2 18.26,56.18 20.09,56.18 M1_F.A
N$37
  Top 0.152: M2_R.A U$61.P$2
N$38
  Top 0.152: U$60.P$2 18.26,38.35 20.09,38.35 M2_F.A
N$39  (via drill 0.35)
  Top 0.152: v26.19,48.87 27.25,49.93 27.86,49.93 U1.8
  Bottom 0.152: v26.19,48.87 26.19,45.97 Y1.3
N$40  (via drill 0.35)
  Top 0.152: v29.23,48.56 28.62,49.17 28.02,49.17 U1.7
  Bottom 0.152: v29.23,48.56 29.23,47.5 26.34,44.6 24.66,44.6 23.75,45.52 23.75,45.82 Y1.1
N$47  (via drill 0.35)
  Top 0.152: v17.96,47.65 19.33,47.65 U1.20
  Bottom 0.152: v17.96,47.65 18.41,48.11 21,48.11 U$47.P$2
RES  (via drill 0.35)
  Top 0.152: 23.6,53.74 22.22,53.74 22.07,53.59 U$45.P$2 | 23.6,53.74 27.1,53.74 31.98,48.87 32.43,48.87 U$55.P$2 | v12.78,49.93 11.56,49.93 S1.2 | v14.45,49.93 15.52,49.93 S1.1 | v23.9,50.09 23.9,42.92 U1.29 23.9,42.77 23.9,42.16 23.29,41.55 20.24,41.55 17.65,38.96 17.65,35.91 16.74,35 15.98,35 15.82,35.15 15.82,36.22 12.62,39.42 12.01,39.42 11.25,38.66 11.25,35 14.69,31.56 14.69,20.71 13.99,20.01 13.99,16.1 U$46.P$7 | v23.6,54.05 23.6,53.74
  Bottom 0.152: v12.78,49.93 v14.45,49.93 15.98,51.46 | v23.9,50.09 23.9,53.14 23.6,53.44 | 23.6,53.44 17.96,53.44 15.98,51.46 | 15.98,51.46 14.76,52.68 13.84,52.68 11.15,55.37 11.15,59.31 12.01,60.17 12.01,65.33 11.56,65.78 10.64,65.78 5.76,70.66 5.76,71.42 12.47,78.13 13.69,78.13 U$62.P$7 | 23.6,53.44 v23.6,54.05
RST
  Top 0.152: U$55.P$1 32.59,50.7 34.57,50.7 34.75,50.54 U$54.P$4
RX  (via drill 0.35)
  Top 0.152: v27.41,42.01 27.25,41.86 25.27,41.86 24.97,42.16 24.97,42.77 U1.30
  Bottom 0.152: v27.41,42.01 28.97,42.01 34.61,47.65 U$54.P$3
SCK
  Top 0.152: U$62.P$6 12.17,76.6 12.17,75.39 9.73,72.95 9.73,64.87 10.79,63.8 12.78,63.8 17.19,59.38 17.19,55.88 17.8,55.27 19.63,55.27 20.7,54.2 20.7,52.83 19.48,51.61 19.48,50.09 U1.17 19.48,49.93 20.09,49.93 21.31,48.72 21.31,44.91 16.28,39.88 12.01,39.88 10.95,38.81 10.95,34.54 14.39,31.1 14.39,21.68 12.62,19.91 12.62,17.47 U$46.P$6
TX
  Top 0.152: U1.31 25.58,42.92 25.58,46.12 24.66,47.04 24.66,48.23 26.97,50.54 28.78,50.54 31.37,47.95 31.37,46.28 32.28,45.36 34.9,45.36 U$54.P$2
VDD  (via drill 0.35)
  Top 0.152: 21.31,80.26 U$1.VCC | U$57.P$1 7.14,29.82 8.08,29.82 9.91,31.65 11.62,31.65 12.1,31.44 U$21.P$1 | U$34.P$1 35.48,10.46
  Top 0.6: CN1.1 13.05,22.29 13.22,22.46
  Top 0.8: v28.78,15.34 28.78,14.93 28.01,14.16 27.27,14.16 U$23.VCC 26.52,13.44 26.49,13.37 U$24.P$1 27.32,9.6 31.29,9.6 31.55,9.33 32.91,9.33 33.94,10.36 U$34.P$1 | U$33.VCC 35.48,12.29 35.48,10.46
  Top 1: U$11.VCC 30.96,80.98 U$12.P$1 29.66,84.06 25.06,84.06 23.88,82.88 U$2.P$1 21.31,81.61 21.31,80.26 | U$1.VCC 21.05,79.95 19.93,79.95 CN3.1
  Top 1.5: U$22.P$1 13.49,71.32
  Top 1.6: U$21.P$1 12.99,30.61 13.16,30.44 13.22,22.46 12.89,22.09
  Top 2: 13.49,71.32 13.49,72.33 CN3.1
  Bottom 0.152: 38.07,58.62 38.07,67.46 U$19.D | 38.07,58.62 38.07,58.34 | 24.51,79.24 U$3.P$1 | 28.78,15.64 35.03,15.64 U$25.P$1 35.18,15.8 35.18,16.71 37.92,19.45 37.92,28.14 U$31.D | 28.78,15.64 24.97,15.64 U$35.P$1 24.81,15.8 18.57,22.05 13.14,22.05 CN1.1 | 28.78,15.64 v28.78,15.34 | 38.07,58.62 U$9.D
  Bottom 1.6: U$31.D 38,29.41 | 38,29.41 U$41.D 38.12,37.03 | CN1.1 18.62,21.96 25.39,15.19 34.62,15.19 37.27,17.84 37.27,28.69 38,29.41
  Bottom 2: 38.07,67.46 U$9.D 42.7,54.81 42.7,42.11 U$41.D | U$19.D 37.92,72.97 33.43,79.2 32.91,79.05 U$13.P$1 32.02,79.18 24.51,79.24 | U$3.P$1 23.15,79.16 18.86,79.09 18.86,78.88 CN3.1